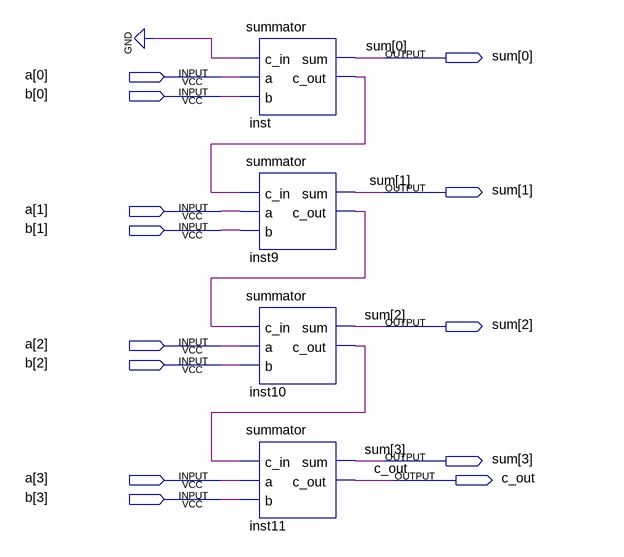
[diagram p0: schematic sheet]
// Quartus schematic Lab1.bdf as structural Verilog: 4 symbols, 13 pins
module Lab1 (
  input  [3:0] a,
  input  [3:0] b,
  output [3:0] sum,
  output c_out
);

  wire inst9_c_out, inst10_c_out, inst_c_out;

  summator inst (.c_in(1'b0), .a(a[0]), .b(b[0]), .sum(sum[0]), .c_out(inst_c_out));
  summator inst9 (.c_in(inst_c_out), .a(a[1]), .b(b[1]), .sum(sum[1]), .c_out(inst9_c_out));
  summator inst10 (.c_in(inst9_c_out), .a(a[2]), .b(b[2]), .sum(sum[2]), .c_out(inst10_c_out));
  summator inst11 (.c_in(inst10_c_out), .a(a[3]), .b(b[3]), .sum(sum[3]), .c_out(c_out));
endmodule
